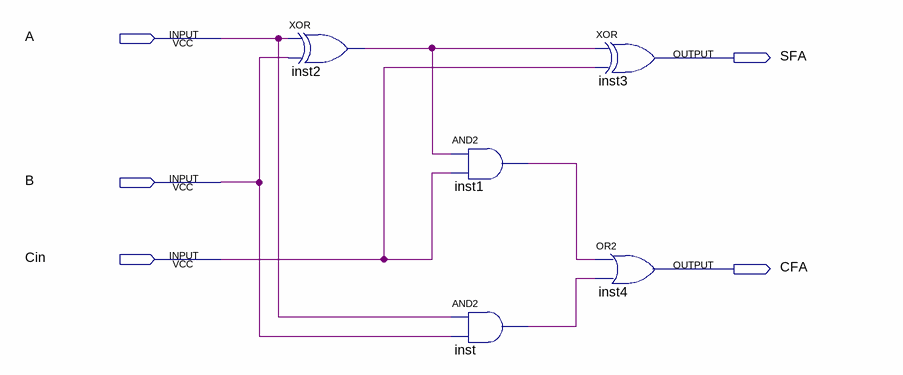
[diagram p0: schematic sheet]
// Quartus schematic FULLA.bdf as structural Verilog: 5 symbols, 5 pins
module FULLA (
  input  A,
  input  B,
  input  Cin,
  output SFA,
  output CFA
);

  wire inst1_out, inst2_out, inst_out;

  xor inst2 (inst2_out, A, B);
  and inst1 (inst1_out, inst2_out, Cin);
  and inst (inst_out, A, B);
  xor inst3 (SFA, inst2_out, Cin);
  or inst4 (CFA, inst1_out, inst_out);
endmodule
